# Altium schematic sheet audio_in_dsp_radio.SchDoc
size A3
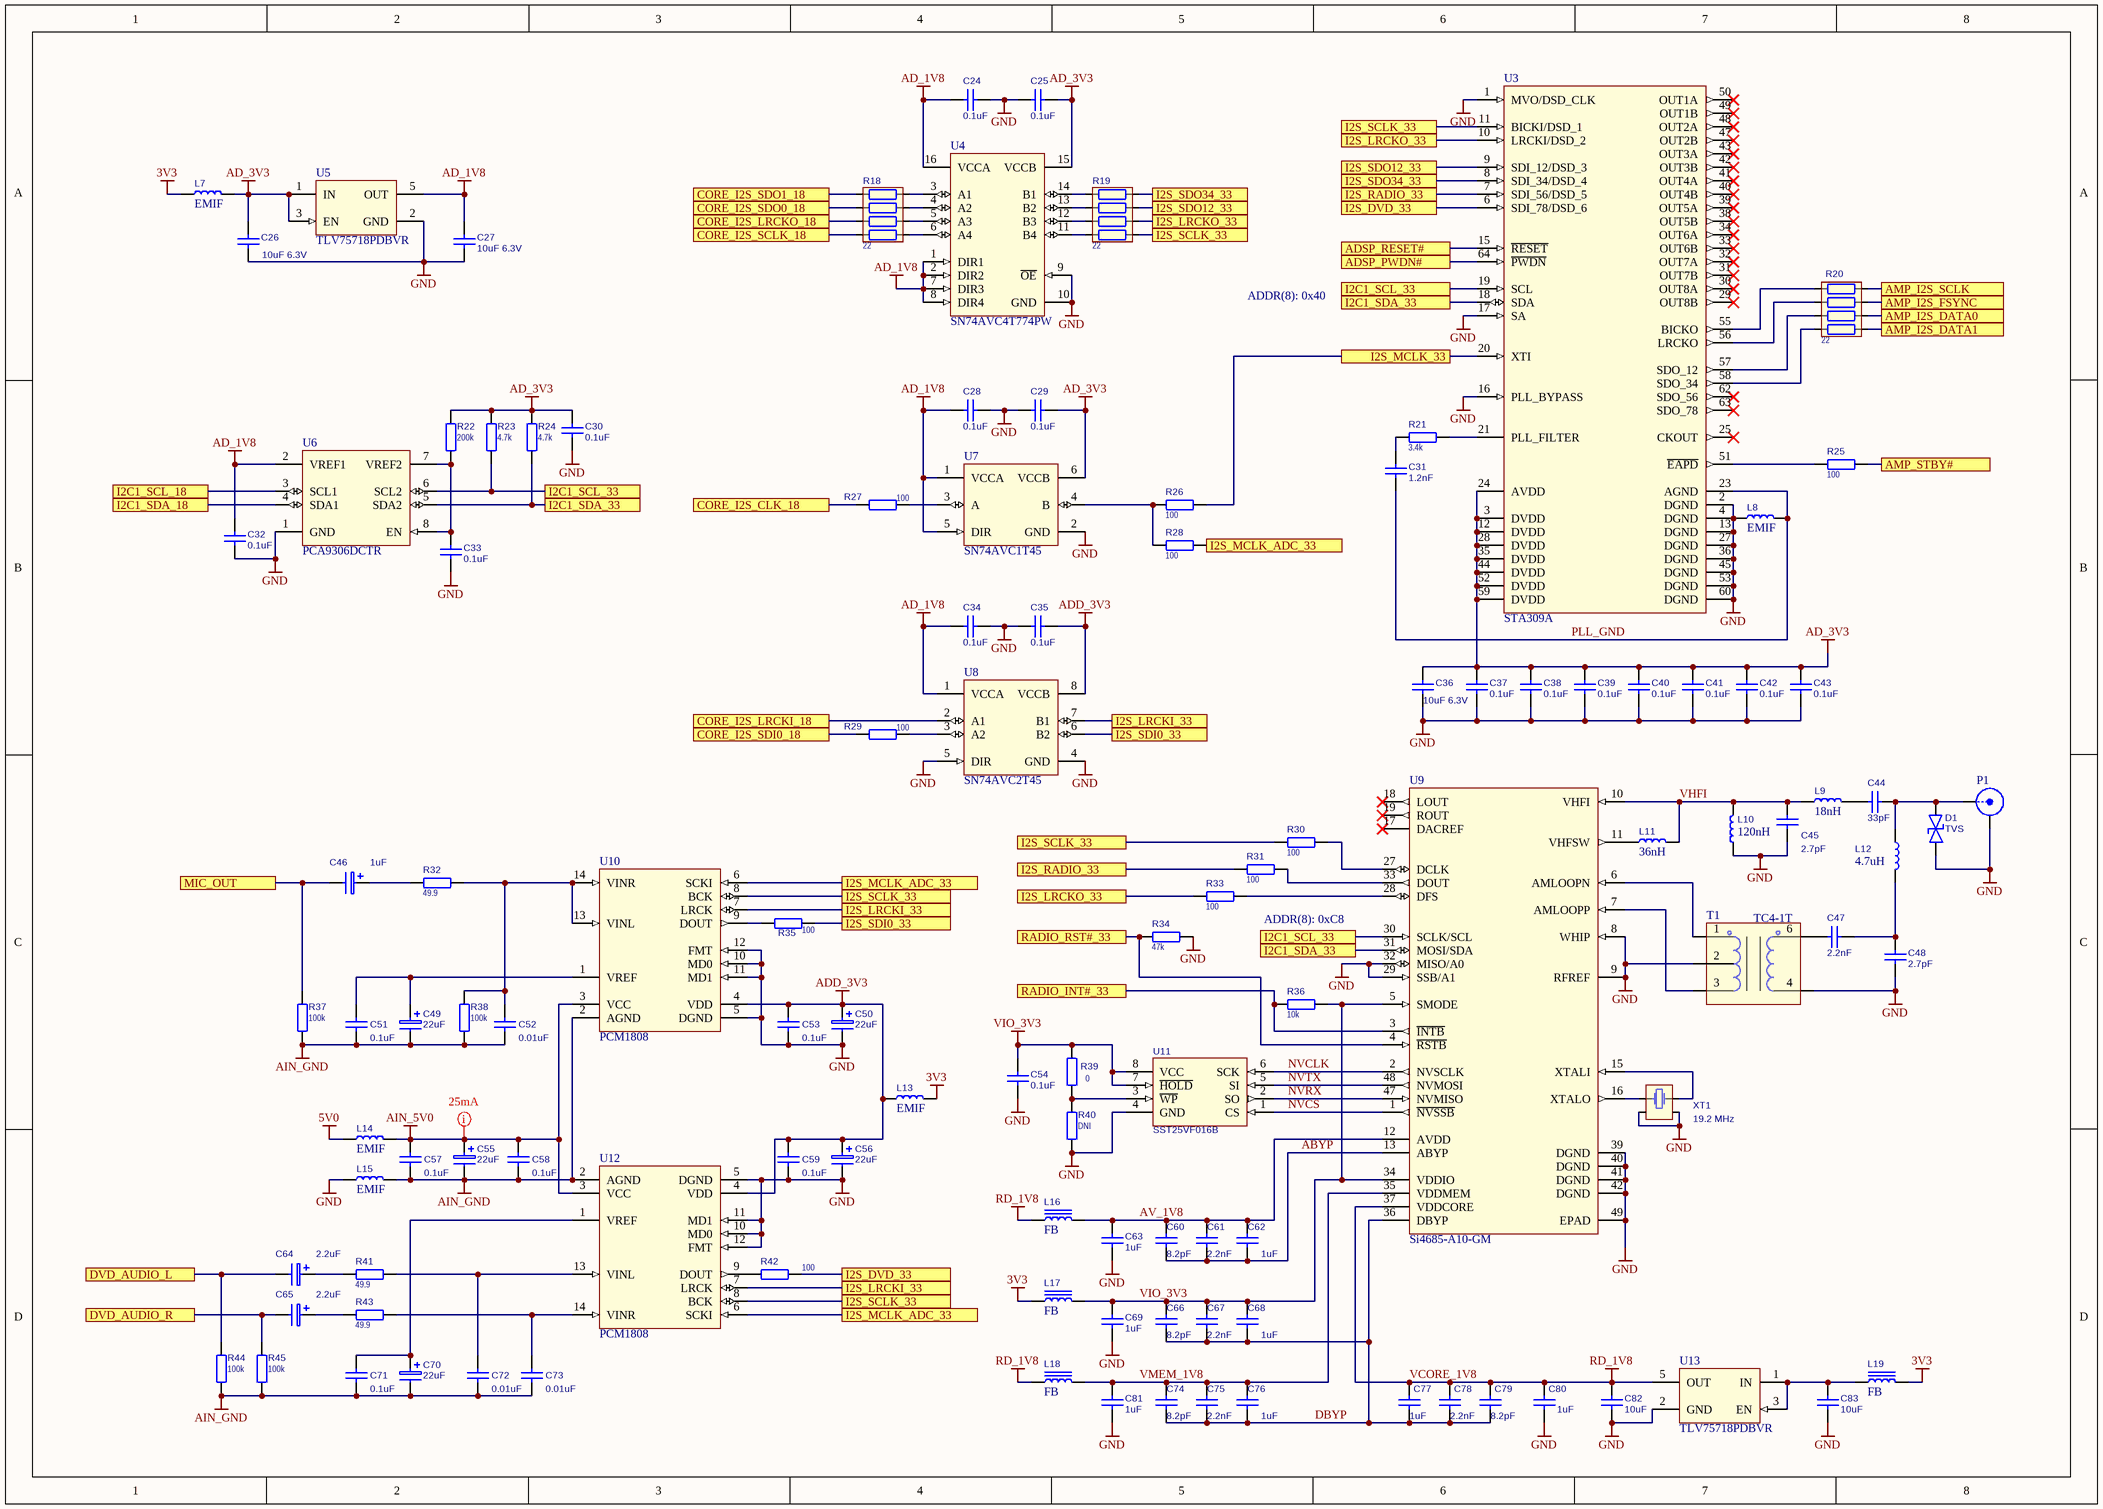
[diagram p0: audio_in_dsp_radio.SchDoc]

## Parts
C24  value 0.1uF  [C0603]  (hidden comment: C1608X7R1H104K080AA)
C25  value 0.1uF  [C0603]  (hidden comment: C1608X7R1H104K080AA)
C26  value 10uF 6.3V  [C0603]  (hidden comment: CC0603MRX5R5BB106)
C27  value 10uF 6.3V  [C0603]  (hidden comment: CC0603MRX5R5BB106)
C28  value 0.1uF  [C0603]  (hidden comment: C1608X7R1H104K080AA)
C29  value 0.1uF  [C0603]  (hidden comment: C1608X7R1H104K080AA)
C30  value 0.1uF  [C0603]  (hidden comment: C1608X7R1H104K080AA)
C31  value 1.2nF  [C0603]  (hidden comment: GRM1885C1H122JA01D)
C32  value 0.1uF  [C0603]  (hidden comment: C1608X7R1H104K080AA)
C33  value 0.1uF  [C0603]  (hidden comment: C1608X7R1H104K080AA)
C34  value 0.1uF  [C0603]  (hidden comment: C1608X7R1H104K080AA)
C35  value 0.1uF  [C0603]  (hidden comment: C1608X7R1H104K080AA)
C36  value 10uF 6.3V  [C0603]  (hidden comment: CC0603MRX5R5BB106)
C37  value 0.1uF  [C0603]  (hidden comment: C1608X7R1H104K080AA)
C38  value 0.1uF  [C0603]  (hidden comment: C1608X7R1H104K080AA)
C39  value 0.1uF  [C0603]  (hidden comment: C1608X7R1H104K080AA)
C40  value 0.1uF  [C0603]  (hidden comment: C1608X7R1H104K080AA)
C41  value 0.1uF  [C0603]  (hidden comment: C1608X7R1H104K080AA)
C42  value 0.1uF  [C0603]  (hidden comment: C1608X7R1H104K080AA)
C43  value 0.1uF  [C0603]  (hidden comment: C1608X7R1H104K080AA)
C44  value 33pF  [C0603]  (hidden comment: 06035A330JAT2A)
C45  value 2.7pF  [C0603]  (hidden comment: GCM1885C2A2R7BA16D)
C46  value 1uF  [TANTAL-A-1206]  (hidden comment: 293D105X9035A2TE3)
C47  value 2.2nF  [C0603]  (hidden comment: CL10B222KB8NNNC)
C48  value 2.7pF  [C0603]  (hidden comment: GCM1885C2A2R7BA16D)
C49  value 22uF  [TANTAL-A-1206]  (hidden comment: 293D226X9010A2TE3)
C50  value 22uF  [TANTAL-A-1206]  (hidden comment: 293D226X9010A2TE3)
C51  value 0.1uF  [C0603]  (hidden comment: CC0603KRX7R9BB104)
C52  value 0.01uF  [C0603]  (hidden comment: CL10B103KB8NNNC)
C53  value 0.1uF  [C0603]  (hidden comment: CC0603KRX7R9BB104)
C54  value 0.1uF  [C0603]  (hidden comment: CC0603KRX7R9BB104)
C55  value 22uF  [TANTAL-A-1206]  (hidden comment: 293D226X9010A2TE3)
C56  value 22uF  [TANTAL-A-1206]  (hidden comment: 293D226X9010A2TE3)
C57  value 0.1uF  [C0603]  (hidden comment: CC0603KRX7R9BB104)
C58  value 0.1uF  [C0603]  (hidden comment: CC0603KRX7R9BB104)
C59  value 0.1uF  [C0603]  (hidden comment: CC0603KRX7R9BB104)
C60  value 8.2pF  [C0603]  (hidden comment: CC0603CRNPO9BN8R2)
C61  value 2.2nF  [C0603]  (hidden comment: CL10B222KB8NNNC)
C62  value 1uF  [C0603]  (hidden comment: GRM188R61E105KA12D)
C63  value 1uF  [C0603]  (hidden comment: CC0603KRX7R9BB105)
C64  value 2.2uF  [TANTAL-A-1206]  (hidden comment: 293D225X9010A2TE3)
C65  value 2.2uF  [TANTAL-A-1206]  (hidden comment: 293D225X9010A2TE3)
C66  value 8.2pF  [C0603]  (hidden comment: CC0603CRNPO9BN8R2)
C67  value 2.2nF  [C0603]  (hidden comment: CL10B222KB8NNNC)
C68  value 1uF  [C0603]  (hidden comment: GRM188R61E105KA12D)
C69  value 1uF  [C0603]  (hidden comment: CC0603KRX7R9BB105)
C70  value 22uF  [TANTAL-A-1206]  (hidden comment: 293D226X9010A2TE3)
C71  value 0.1uF  [C0603]  (hidden comment: CC0603KRX7R9BB104)
C72  value 0.01uF  [C0603]  (hidden comment: CL10B103KB8NNNC)
C73  value 0.01uF  [C0603]  (hidden comment: CL10B103KB8NNNC)
C74  value 8.2pF  [C0603]  (hidden comment: CC0603CRNPO9BN8R2)
C75  value 2.2nF  [C0603]  (hidden comment: CL10B222KB8NNNC)
C76  value 1uF  [C0603]  (hidden comment: GRM188R61E105KA12D)
C77  value 1uF  [C0603]  (hidden comment: CC0603KRX7R9BB105)
C78  value 2.2nF  [C0603]  (hidden comment: CL10B222KB8NNNC)
C79  value 8.2pF  [C0603]  (hidden comment: CC0603CRNPO9BN8R2)
C80  value 1uF  [C0603]  (hidden comment: GRM188R61E105KA12D)
C81  value 1uF  [C0603]  (hidden comment: CC0603KRX7R9BB105)
C82  value 10uF  [C0603]  (hidden comment: CC0603MRX5R5BB106)
C83  value 10uF  [C0603]  (hidden comment: CC0603MRX5R5BB106)
D1  value TVS  [SOD-323]  (hidden comment: CDSOD323-T05LC)
L7  value EMIF  [IND0805]  (hidden comment: BLM21PG221SN1D)
L8  value EMIF  [IND0603]  (hidden comment: BLM18AG102SN1D)
L9  value 18nH  [IND0603]  (hidden comment: LQW18AN18NJ0ZD)
L10  value 120nH  [IND0603]  (hidden comment: LQW18ANR12J00D)
L11  value 36nH  [IND0603]  (hidden comment: LQW18AN36NG00D)
L12  value 4.7uH  [IND0603]  (hidden comment: CIL 10J 4R7)
L13  value EMIF  [IND0603]  (hidden comment: BLM18AG102SN1D)
L14  value EMIF  [IND0603]  (hidden comment: BLM18AG102SN1D)
L15  value EMIF  [IND0603]  (hidden comment: BLM18AG102SN1D)
L16  value FB  [IND0603]  (hidden comment: BLM18AG102SN1D)
L17  value FB  [IND0603]  (hidden comment: BLM18AG102SN1D)
L18  value FB  [IND0603]  (hidden comment: BLM18AG102SN1D)
L19  value FB  [IND0603]  (hidden comment: BLM18AG102SN1D)
P1  I-PEX  [SMA-RIGHT]  (value not drawn)
R18  value 22  [R0804X4]  (hidden comment: TC124-JR-0722RL)
R19  value 22  [R0804X4]  (hidden comment: TC124-JR-0722RL)
R20  value 22  [R0804X4]  (hidden comment: TC124-JR-0722RL)
R21  3.4k  [R0603]
R22  200k  [R0603]
R23  4.7k  [R0603]
R24  4.7k  [R0603]
R25  100  [R0603]
R26  100  [R0603]
R27  100  [R0603]
R28  100  [R0603]
R29  100  [R0603]
R30  100  [R0603]
R31  100  [R0603]
R32  49.9  [R0603]
R33  100  [R0603]
R34  47k  [R0603]
R35  100  [R0603]
R36  10k  [R0603]
R37  100k  [R0603]
R38  100k  [R0603]
R39  0  [R0603]
R40  DNI  [R0603]
R41  49.9  [R0603]
R42  100  [R0603]
R43  49.9  [R0603]
R44  100k  [R0603]
R45  100k  [R0603]
T1  TC4-1T  [AT224]
U3  STA309A  [LQFP64_N]
U4  SN74AVC4T774PW  [TSSOP-16]
U5  TLV75718PDBVR  [SOT-23-5]
U6  PCA9306DCTR  [SSOP-8]
U7  SN74AVC1T45  [SOT-23-6]
U8  SN74AVC2T45  [SSOP-8]
U9  value Si4685-A10-GM  [QFN-48-7X7]  (hidden comment: Si473x-GM)
U10  PCM1808  [TSSOP-14]
U11  SST25VF016B  [SOIC8WA]
U12  PCM1808  [TSSOP-14]
U13  TLV75718PDBVR  [SOT-23-5]
XT1  value 19.2 MHz  [NX3225]  (hidden comment: NX3225GA-19.2M)

## Ports
ADSP_PWDN#, ADSP_RESET#, AMP_I2S_DATA0, AMP_I2S_DATA1, AMP_I2S_FSYNC, AMP_I2S_SCLK, AMP_STBY#, CORE_I2S_CLK_18, CORE_I2S_LRCKI_18, CORE_I2S_LRCKO_18, CORE_I2S_SCLK_18, CORE_I2S_SDI0_18, CORE_I2S_SDO0_18, CORE_I2S_SDO1_18, DVD_AUDIO_L, DVD_AUDIO_R, I2C1_SCL_18, I2C1_SCL_33, I2C1_SDA_18, I2C1_SDA_33, I2S_DVD_33, I2S_LRCKI_33, I2S_LRCKO_33, I2S_MCLK_33, I2S_MCLK_ADC_33, I2S_RADIO_33, I2S_SCLK_33, I2S_SDI0_33, I2S_SDO12_33, I2S_SDO34_33, MIC_OUT, RADIO_INT#_33, RADIO_RST#_33

## Nets
3V3: L7.2 L13.1 L17.2 L19.1
5V0: L14.2
AD_1V8: C24.2 C27.1 C28.2 C32.2 C34.2 U4.1(DIR1) U4.2(DIR2) U4.7(DIR3) U4.8(DIR4) U4.16(VCCA) U5.5(OUT) U6.2(VREF1) U7.1(VCCA) U7.5(DIR) U8.1(VCCA)
AD_3V3: C25.1 C26.1 C29.1 C30.2 C36.1 C37.2 C38.2 C39.2 C40.2 C41.2 C42.2 C43.2 L7.1 R22.1 R23.1 R24.1 U3.3(DVDD) U3.12(DVDD) U3.24(AVDD) U3.28(DVDD) U3.35(DVDD) U3.44(DVDD) U3.52(DVDD) U3.59(DVDD) U4.15(VCCB) U5.1(IN) U5.3(EN) U7.6(VCCB)
ADD_3V3: C35.1 C50.1(+) C53.1 C56.1(+) C59.1 L13.2 U8.8(VCCB) U10.4(VDD) U12.4(VDD)
AIN_5V0: C55.1(+) C57.1 C58.1 L14.1 U10.3(VCC) U12.3(VCC)
AIN_GND: C49.2(-) C51.2 C52.2 C55.2(-) C57.2 C58.2 C70.2(-) C71.2 C72.2 C73.2 L15.1 R37.2 R38.2 R44.2 R45.2 U10.2(AGND) U12.2(AGND)
GND: C24.1 C25.2 C26.2 C27.2 C28.1 C29.2 C30.1 C32.1 C33.1 C34.1 C35.2 C36.2 C37.1 C38.1 C39.1 C40.1 C41.1 C42.1 C43.1 C45.1 C48.1 C50.2(-) C53.2 C54.2 C56.2(-) C59.2 C63.2 C69.2 C80.2 C81.2 C82.2 C83.2 D1.1 L8.2 L10.2 L15.2 P1.2(Y) R34.2 R40.1 T1.2 T1.4 U3.1(MVO/DSD_CLK) U3.2(DGND) U3.4(DGND) U3.13(DGND) U3.16(PLL_BYPASS) U3.17(SA) U3.27(DGND) U3.36(DGND) U3.45(DGND) U3.53(DGND) U3.60(DGND) U4.9(~{OE}) U4.10(GND) U5.2(GND) U6.1(GND) U7.2(GND) U8.4(GND) U8.5(DIR) U9.8(WHIP) U9.9(RFREF) U9.29(SSB/A1) U9.32(MISO/A0) U9.39(DGND) U9.40(DGND) U9.41(DGND) U9.42(DGND) U9.49(EPAD) U10.5(DGND) U10.10(MD0) U10.11(MD1) U10.12(FMT) U11.4(GND) U12.5(DGND) U12.10(MD0) U12.11(MD1) U12.12(FMT) U13.2(GND) XT1.2(GND) XT1.4(GND)
VCORE_1V8: C77.1 C78.1 C79.1 C80.1 C82.1 L16.2 L18.2 U9.37(VDDCORE) U13.5(OUT)  [also labelled RD_1V8]
VIO_3V3: C54.1 C66.1 C67.1 C68.1 C69.1 L17.1 R36.2 R39.2 U9.5(SMODE) U9.34(VDDIO) U11.7(~{HOLD}) U11.8(VCC)
ABYP: C60.2 C61.2 C62.2 U9.13(ABYP)
ADSP_PWDN#: U3.64(~{PWDN}) ; port ADSP_PWDN#
ADSP_RESET#: U3.15(~{RESET}) ; port ADSP_RESET#
AMP_I2S_DATA0: R20.5 ; port AMP_I2S_DATA0
AMP_I2S_DATA1: R20.7 ; port AMP_I2S_DATA1
AMP_I2S_FSYNC: R20.3 ; port AMP_I2S_FSYNC
AMP_I2S_SCLK: R20.1 ; port AMP_I2S_SCLK
AMP_STBY#: R25.2 ; port AMP_STBY#
AV_1V8: C60.1 C61.1 C62.1 C63.1 L16.1 U9.12(AVDD)
CORE_I2S_CLK_18: R27.1 ; port CORE_I2S_CLK_18
CORE_I2S_LRCKI_18: U8.2(A1) ; port CORE_I2S_LRCKI_18
CORE_I2S_LRCKO_18: R18.4 ; port CORE_I2S_LRCKO_18
CORE_I2S_SCLK_18: R18.2 ; port CORE_I2S_SCLK_18
CORE_I2S_SDI0_18: R29.1 ; port CORE_I2S_SDI0_18
CORE_I2S_SDO0_18: R18.6 ; port CORE_I2S_SDO0_18
CORE_I2S_SDO1_18: R18.8 ; port CORE_I2S_SDO1_18
DBYP: C66.2 C67.2 C68.2 C74.2 C75.2 C76.2 C77.2 C78.2 C79.2 U9.36(DBYP)
DVD_AUDIO_L: C64.2(-) R44.1 ; port DVD_AUDIO_L
DVD_AUDIO_R: C65.2(-) R45.1 ; port DVD_AUDIO_R
I2C1_SCL_18: U6.3(SCL1) ; port I2C1_SCL_18
I2C1_SCL_33: R23.2 U3.19(SCL) U6.6(SCL2) U9.30(SCLK/SCL) ; port I2C1_SCL_33
I2C1_SDA_18: U6.4(SDA1) ; port I2C1_SDA_18
I2C1_SDA_33: R24.2 U3.18(SDA) U6.5(SDA2) U9.31(MOSI/SDA) ; port I2C1_SDA_33
I2S_DVD_33: R42.2 U3.6(SDI_78/DSD_6) ; port I2S_DVD_33
I2S_LRCKI_33: U8.7(B1) U10.7(LRCK) U12.7(LRCK) ; port I2S_LRCKI_33
I2S_LRCKO_33: R19.3 R33.1 U3.10(LRCKI/DSD_2) ; port I2S_LRCKO_33
I2S_MCLK_33: R26.2 U3.20(XTI) ; port I2S_MCLK_33
I2S_MCLK_ADC_33: R28.2 U10.6(SCKI) U12.6(SCKI) ; port I2S_MCLK_ADC_33
I2S_RADIO_33: R31.1 U3.7(SDI_56/DSD_5) ; port I2S_RADIO_33
I2S_SCLK_33: R19.1 R30.1 U3.11(BICKI/DSD_1) U10.8(BCK) U12.8(BCK) ; port I2S_SCLK_33
I2S_SDI0_33: R35.2 U8.6(B2) ; port I2S_SDI0_33
I2S_SDO12_33: R19.5 U3.9(SDI_12/DSD_3) ; port I2S_SDO12_33
I2S_SDO34_33: R19.7 U3.8(SDI_34/DSD_4) ; port I2S_SDO34_33
MIC_OUT: C46.2(-) R37.1 ; port MIC_OUT
NVCLK: U9.2(NVSCLK) U11.6(SCK)
NVCS: U9.1(~{NVSSB}) U11.1(CS)
NVRX: U9.47(NVMISO) U11.2(SO)
NVTX: U9.48(NVMOSI) U11.5(SI)
PLL_GND: C31.2 L8.1 U3.23(AGND)
RADIO_INT#_33: R36.1 U9.3(~{INTB}) ; port RADIO_INT#_33
RADIO_RST#_33: R34.1 U9.4(~{RSTB}) ; port RADIO_RST#_33
VHFI: C45.2 L9.2 L10.1 L11.1 U9.10(VHFI)
VMEM_1V8: C74.1 C75.1 C76.1 C81.1 L18.1 U9.35(VDDMEM)
NetC31_1: C31.1 R21.2
NetC33_2: C33.2 R22.2 U6.7(VREF2) U6.8(EN)
NetC44_1: C44.1 L9.1
NetC44_2: C44.2 D1.2 L12.2 P1.1(X)
NetC46_1: C46.1(+) R32.1
NetC47_1: C47.1 T1.6
NetC47_2: C47.2 C48.2 L12.1
NetC49_1: C49.1(+) C51.1 U10.1(VREF)
NetC52_1: C52.1 R32.2 R38.1 U10.13(VINL) U10.14(VINR)
NetC64_1: C64.1(+) R41.1
NetC65_1: C65.1(+) R43.1
NetC70_1: C70.1(+) C71.1 U12.1(VREF)
NetC72_1: C72.1 R41.2 U12.13(VINL)
NetC73_1: C73.1 R43.2 U12.14(VINR)
NetC83_1: C83.1 L19.2 U13.1(IN) U13.3(EN)
NetL11_2: L11.2 U9.11(VHFSW)
NetR18_1: R18.1 U4.6(A4)
NetR18_3: R18.3 U4.5(A3)
NetR18_5: R18.5 U4.4(A2)
NetR18_7: R18.7 U4.3(A1)
NetR19_2: R19.2 U4.11(B4)
NetR19_4: R19.4 U4.12(B3)
NetR19_6: R19.6 U4.13(B2)
NetR19_8: R19.8 U4.14(B1)
NetR20_2: R20.2 U3.55(BICKO)
NetR20_4: R20.4 U3.56(LRCKO)
NetR20_6: R20.6 U3.57(SDO_12)
NetR20_8: R20.8 U3.58(SDO_34)
NetR21_1: R21.1 U3.21(PLL_FILTER)
NetR25_1: R25.1 U3.51(~{EAPD})
NetR26_1: R26.1 R28.1 U7.4(B)
NetR27_2: R27.2 U7.3(A)
NetR29_2: R29.2 U8.3(A2)
NetR30_2: R30.2 U9.27(DCLK)
NetR31_2: R31.2 U9.33(DOUT)
NetR33_2: R33.2 U9.28(DFS)
NetR35_1: R35.1 U10.9(DOUT)
NetR39_1: R39.1 R40.2 U11.3(~{WP})
NetR42_1: R42.1 U12.9(DOUT)
NetT1_1: T1.1 U9.6(AMLOOPN)
NetT1_3: T1.3 U9.7(AMLOOPP)
NetU9_15: U9.15(XTALI) XT1.1
NetU9_16: U9.16(XTALO) XT1.3

Not connected (* = marked no-connect by the designer): U3 25(CKOUT)* 29(OUT8B)* 30(OUT8A)* 31(OUT7B)* 32(OUT7A)* 33(OUT6B)* 34(OUT6A)* 38(OUT5B)* 39(OUT5A)* 40(OUT4B)* 41(OUT4A)* 42(OUT3B)* 43(OUT3A)* 47(OUT2B)* 48(OUT2A)* 49(OUT1B)* 50(OUT1A)* 62(SDO_56)* 63(SDO_78)*; U9 17(DACREF)* 18(LOUT)* 19(ROUT)*

## Layout directives
mark named 25mA: AIN_5V0

## Notes on the sheet
- ADDR(8): 0x40
- ADDR(8): 0xC8

## Library data of the parts
C24-C45 C47 C48 C51-C54 C57-C63 C66-C69 C71-C83 = CAP_NPOL
C46 C49 C50 C55 C56 C64 C65 C70 = CAP_POL
D1 = TVS_BIDIR: TVS Diodes
L7-L15 = IND_WO_IRON
L16-L19 = IND_W_IRON
P1 = BNC: LatestRevisionDate: 17-Jul-2002; LatestRevisionNote: Re-released for DXP Platform.; Publisher: Altium Limited
R18-R20 = ARRAY
R21-R45 = RESISTOR: RES
  R21: Value: 3.4k
  R22: Value: 200k
  R23 R24: Value: 4.7k
  R25-R31 R33 R35 R42: Value: 100
  R32 R41 R43: Value: 49.9
  R34: Value: 47k
  R36: Value: 10k
  R37 R38 R44 R45: Value: 100k
  R39: Value: 0
  R40: Value: DNI
T1 = TC4-1T: RF WIDEBAND; value: TC4-1T
U3 = STA309A: Multi-channel digital audio processor with DDX®; Value: STA309A
U4 = SN74AVC4T774PW: 4-Bit Dual-Supply Bus Transceiver With Configurable Voltage-Level Shifting and 3-State Outputs; value: SN74AVC4T774
U5 = TLV733P: Capacitor-Free, 300-mA, Low-Dropout Regulator with Foldback Current Limit for Portable Devices; value: TLV733P
U6 = PCA9306: PCA9306 Dual Bidirectional I2C Bus and SMBus Voltage-Level Translator; value: PCA9306DCTR
U7 = SN74AVC1T45: SN74AVC4T245 Dual-Bit Bus Transceiver with Configurable Voltage Translation and 3-State Outputs; value: SN74AVC1T45
U8 = SN74AVC2T45: SN74AVC4T245 Dual-Bit Bus Transceiver with Configurable Voltage Translation and 3-State Outputs; value: SN74AVC2T45
U9 = Si468x-GM: BROADCAST AM/AMHD-FM/FMHD-DAB/DAB+ RADIO RECEIVER
U10 U12 = PCM1808: PCM1808 Single-Ended, Analog-Input 24-Bit, 96-kHz Stereo ADC; value: PCM1808
U11 = AT25DF161: AT25DF161-SH-T; Value: SST25VF016B
U13 = TLV733P: Capacitor-Free, 1A, Low-Dropout Regulator with Foldback Current Limit for Portable Devices; value: TLV75718PDBVR
XT1 = XTAL4: Crystal rezonator 4 pins